# Altium schematic sheet 0082_USB3.SchDoc
size 848 x 558 mm
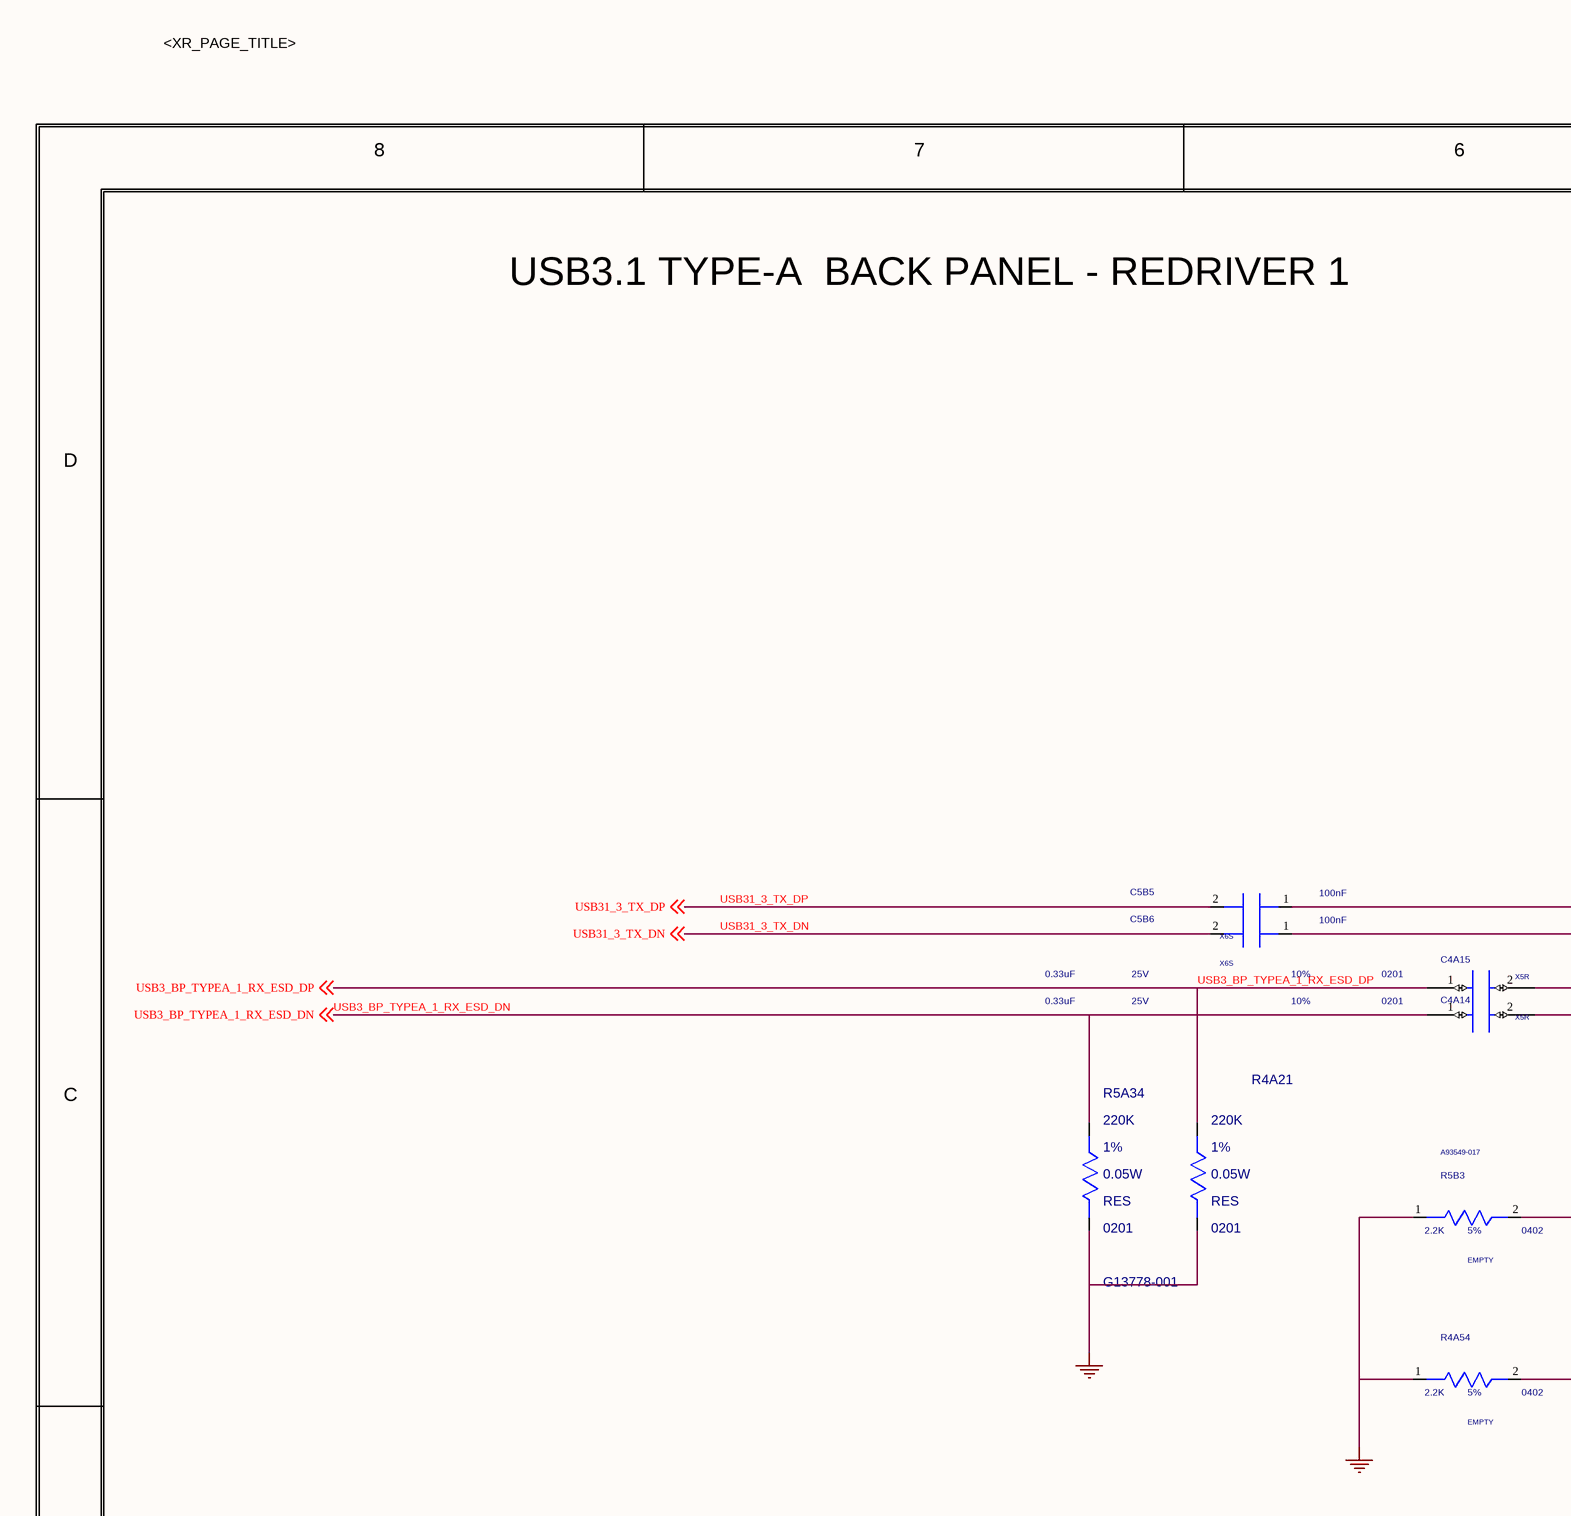
[diagram p0: 0082_USB3.SchDoc, top left]
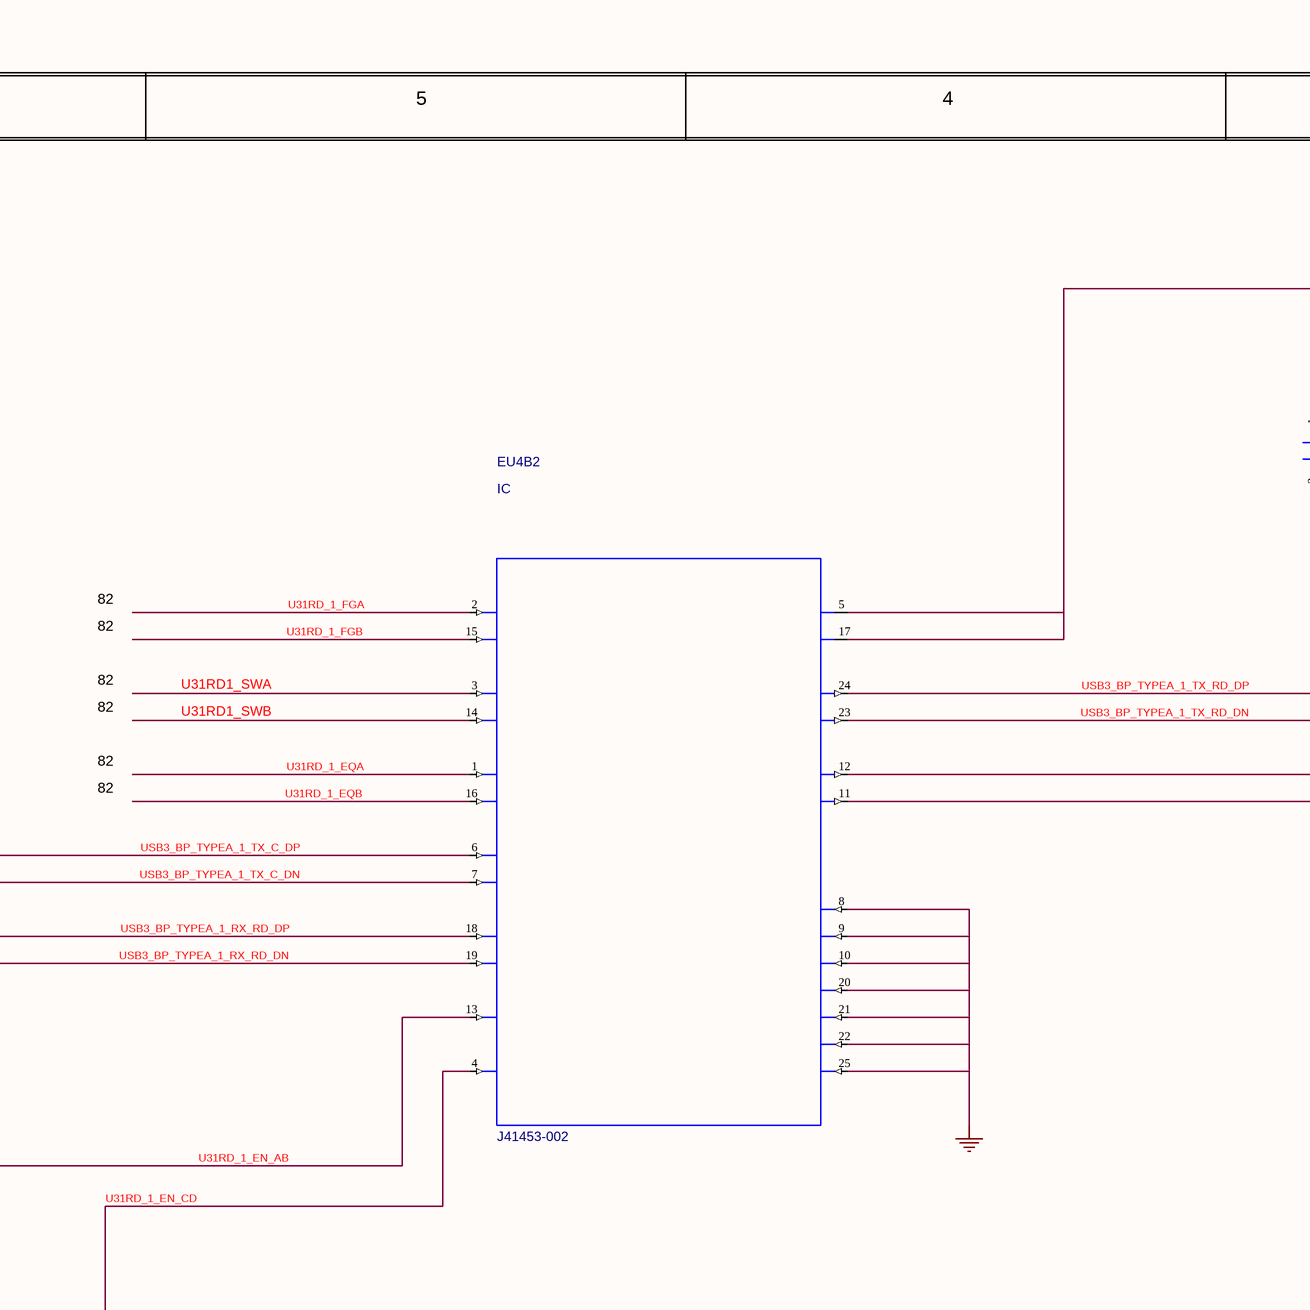
[diagram p1: 0082_USB3.SchDoc, top middle]
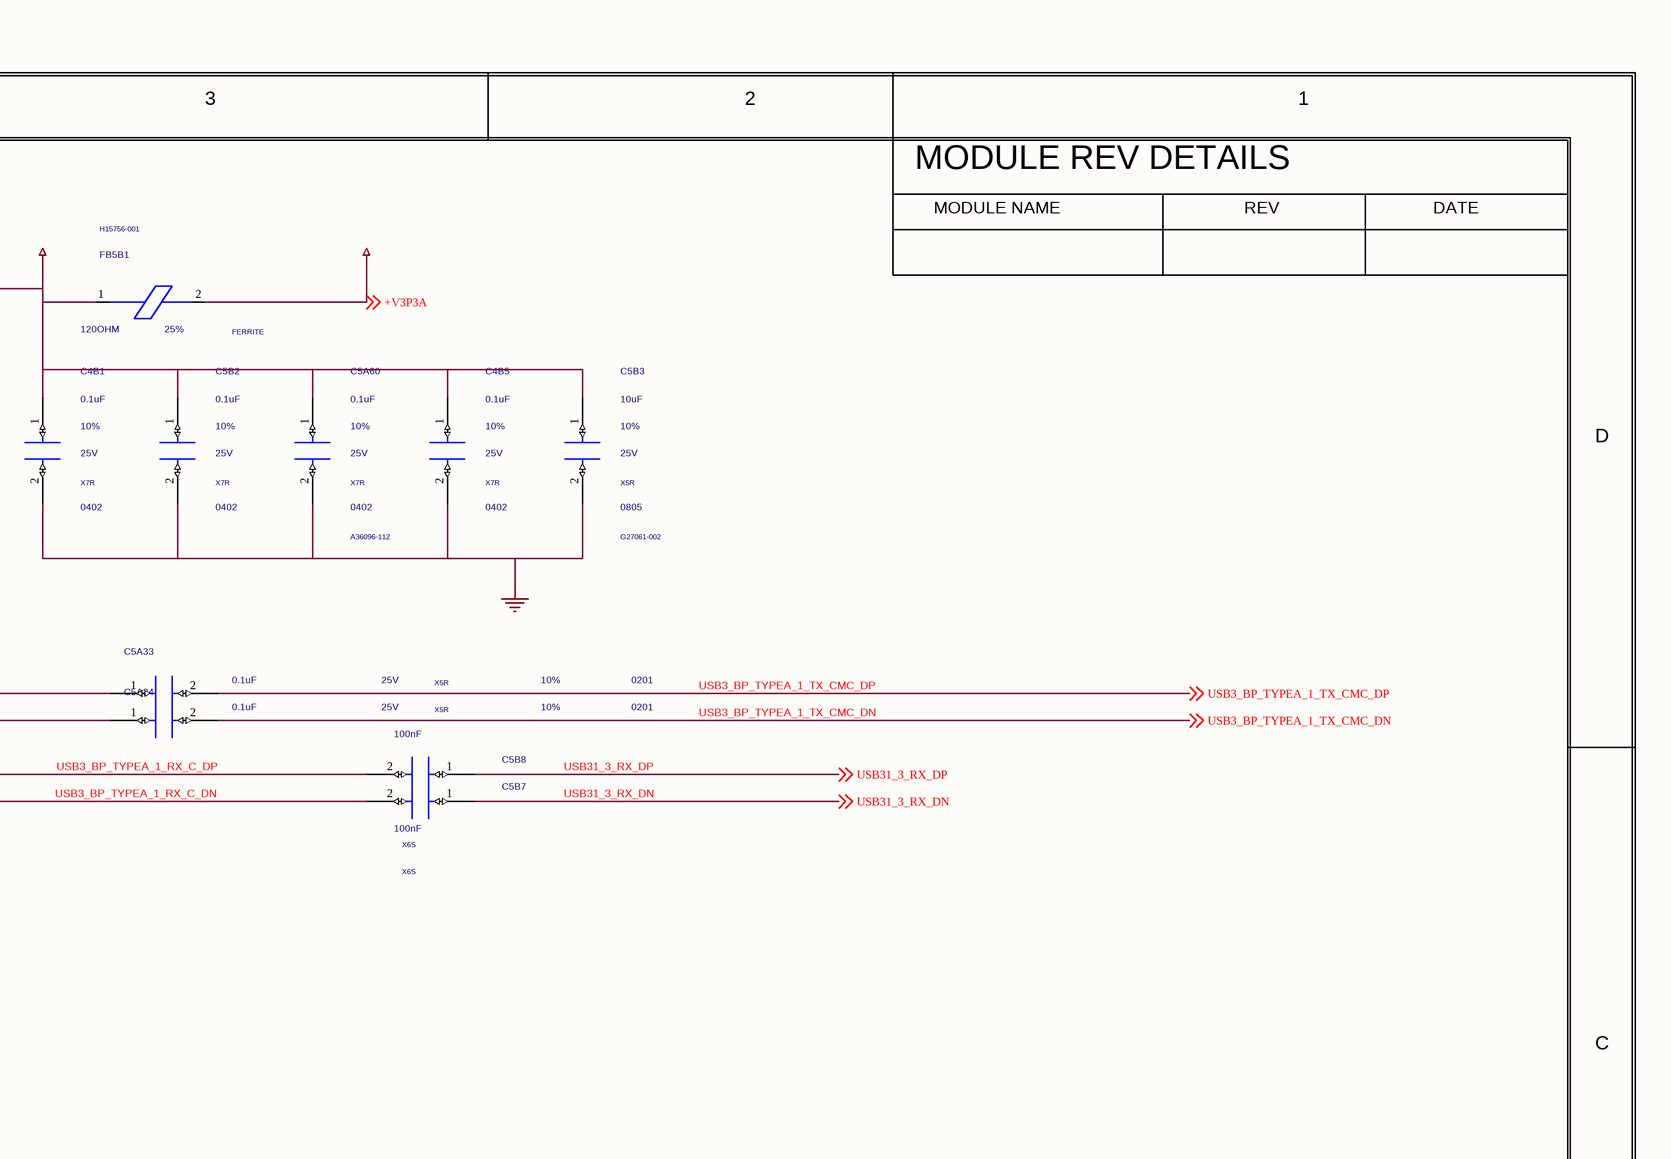
[diagram p2: 0082_USB3.SchDoc, top right]
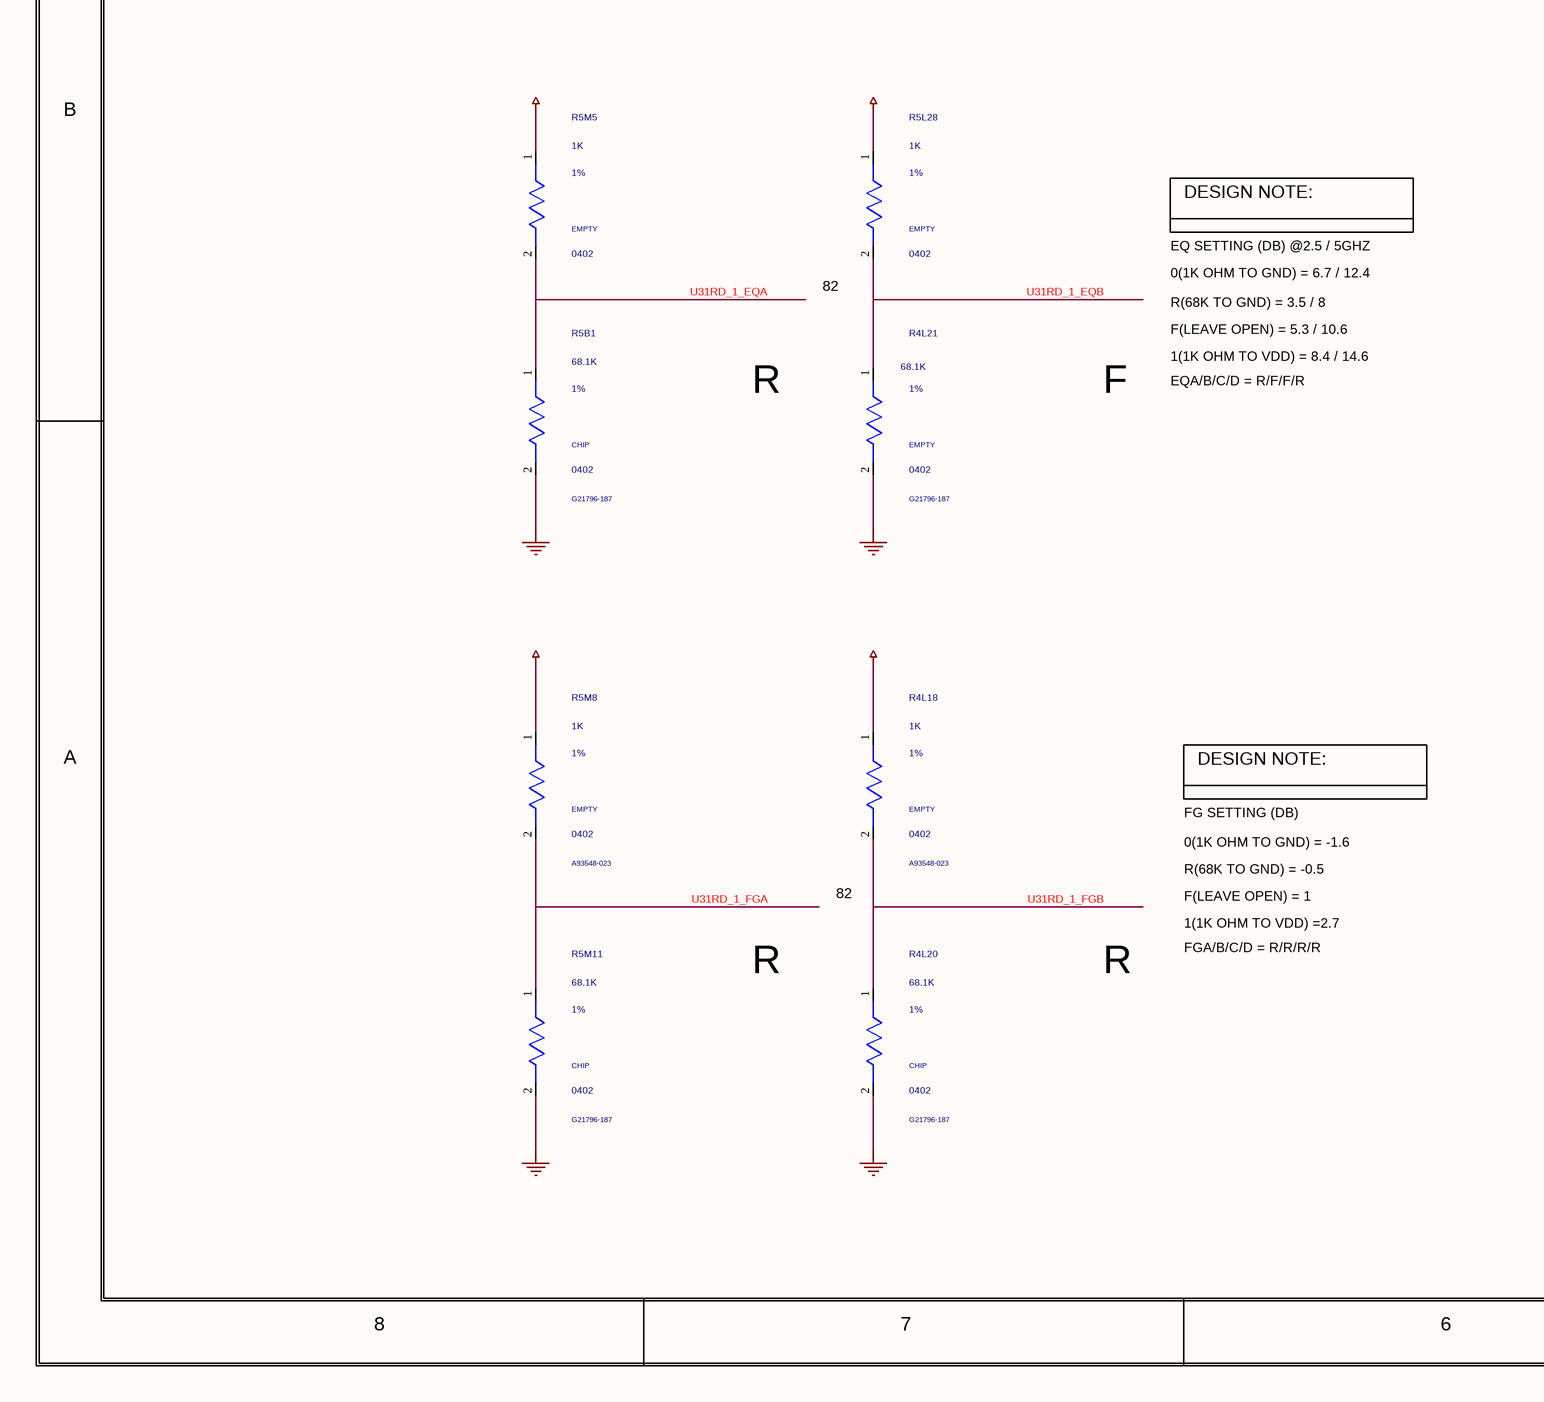
[diagram p3: 0082_USB3.SchDoc, bottom left]
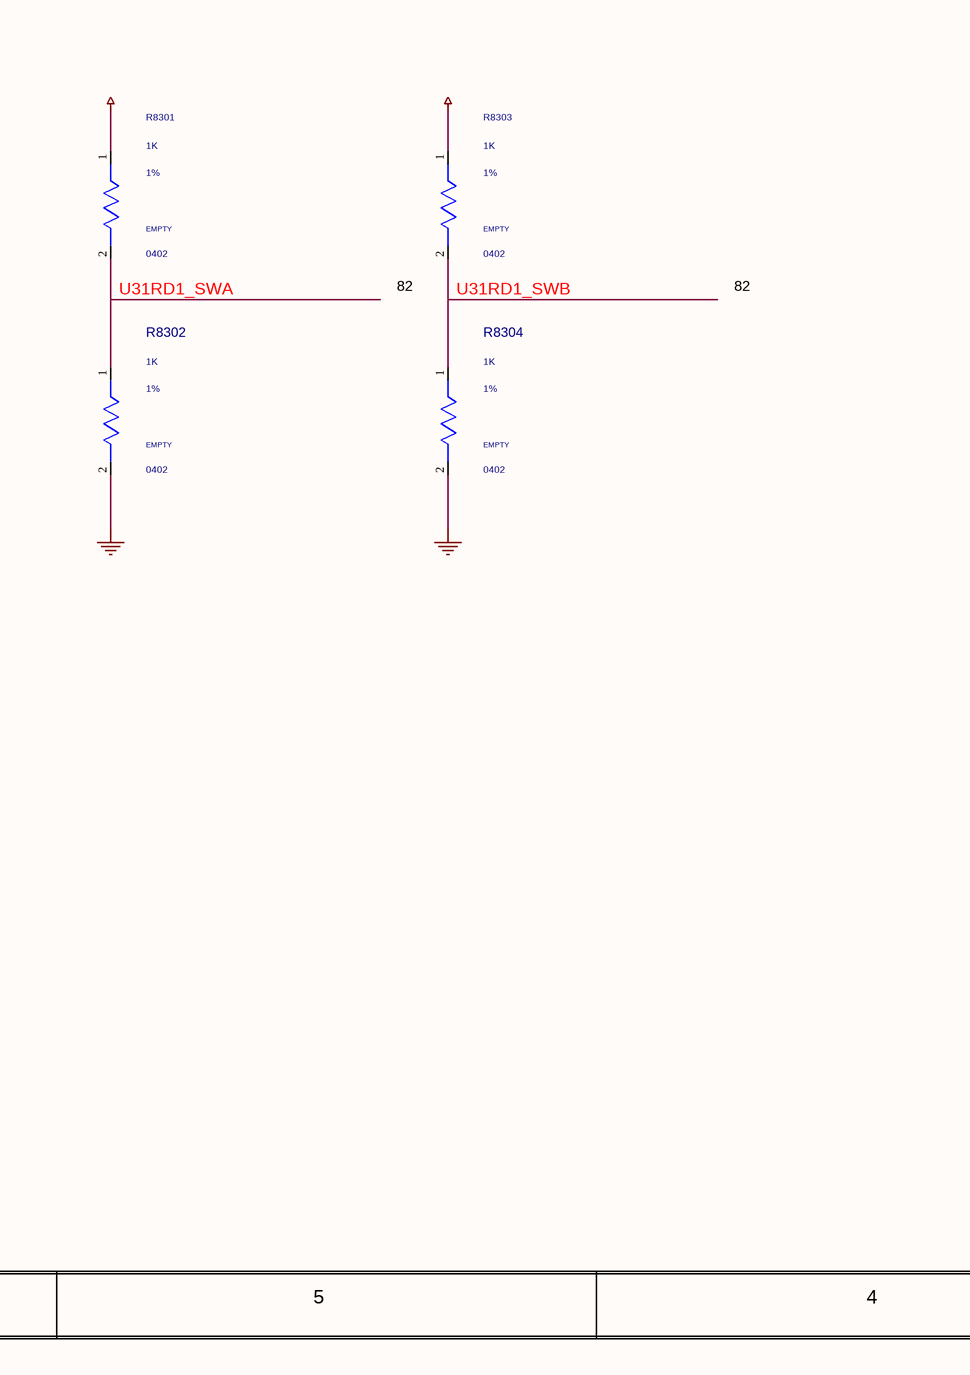
[diagram p4: 0082_USB3.SchDoc, bottom middle]
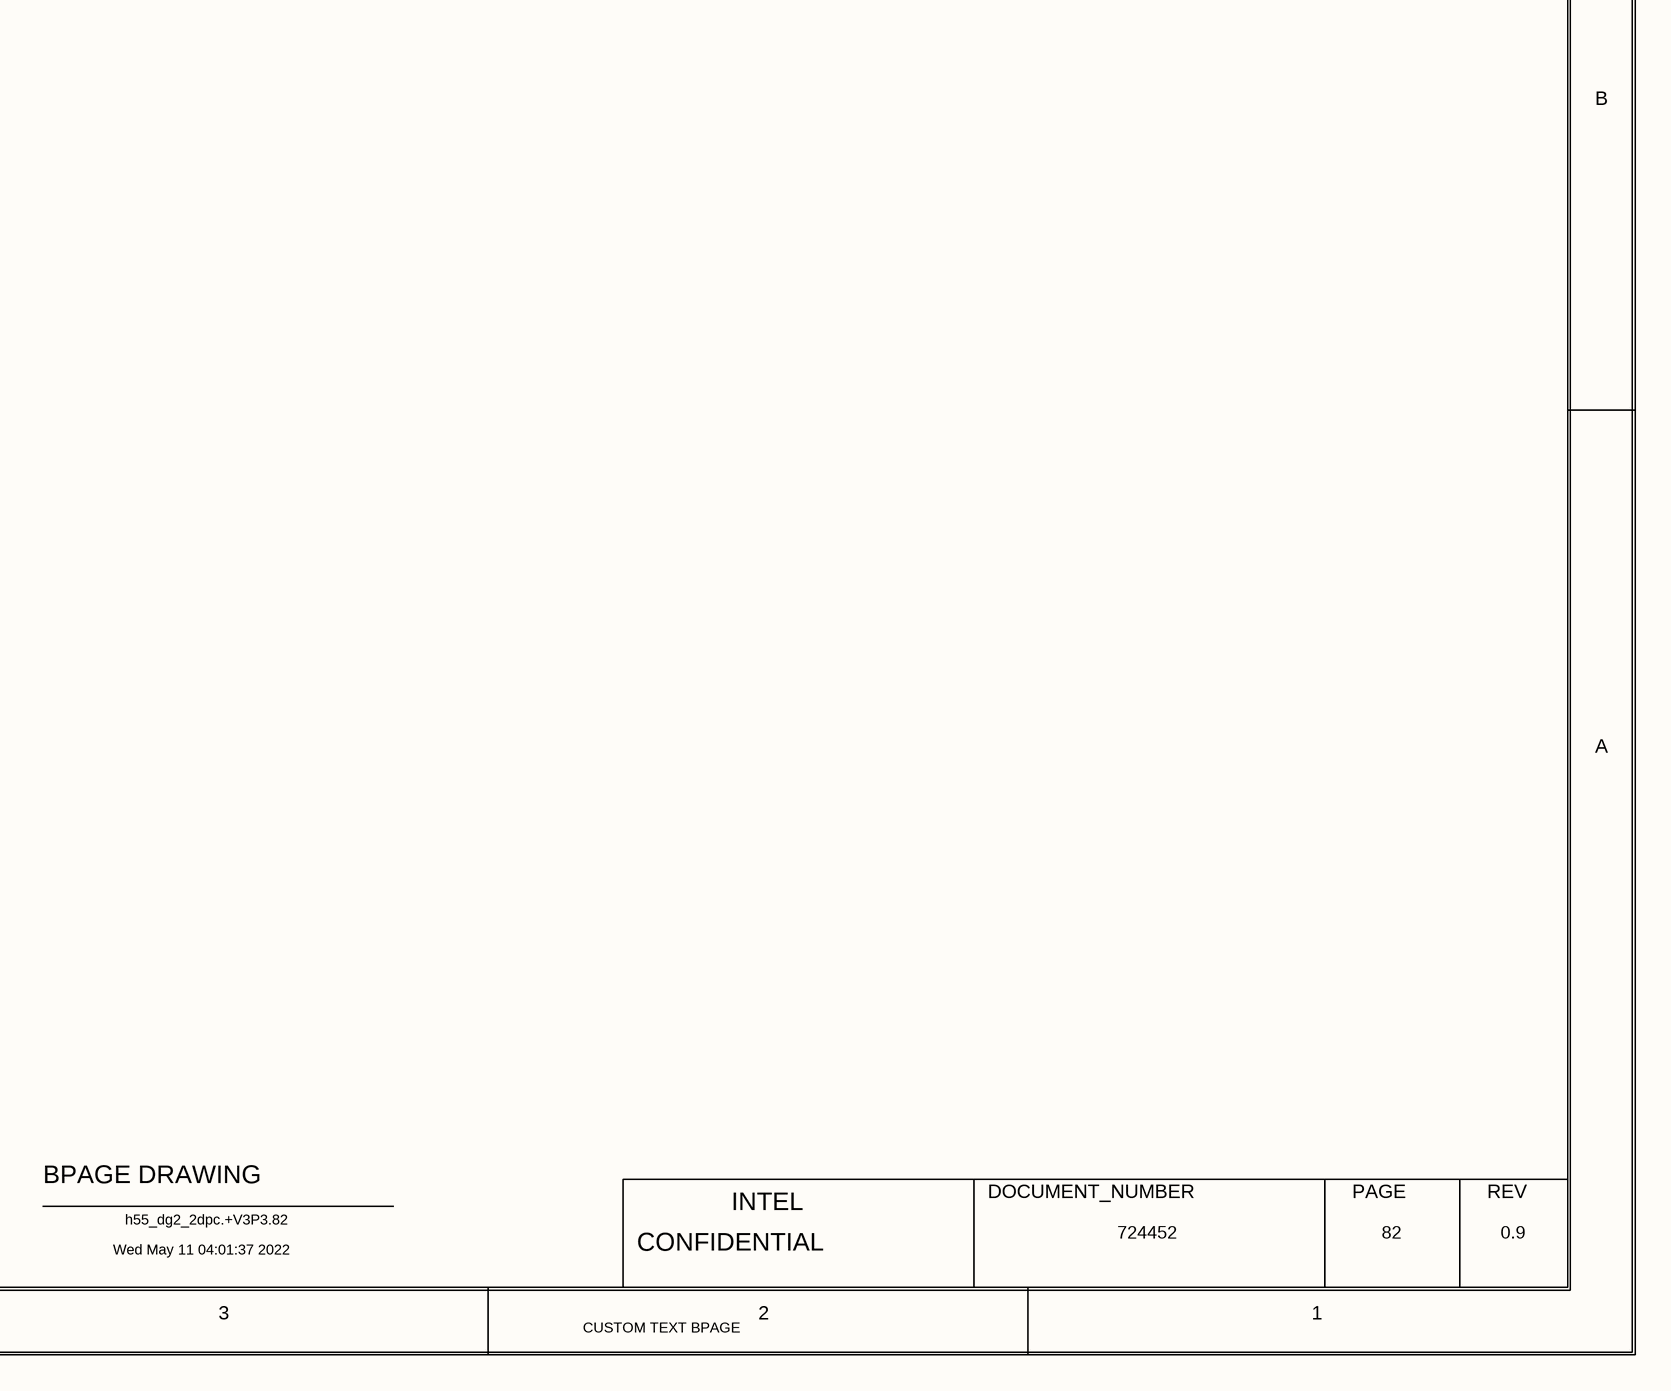
[diagram p5: 0082_USB3.SchDoc, bottom right]

## Parts
C4A14  0.33uF  MATERIAL: X5R  PACK_TYPE: 0201  TOLERANCE: 10%  VOLTAGE: 25V  [SMC0201IA]
C4A15  0.33uF  MATERIAL: X5R  PACK_TYPE: 0201  TOLERANCE: 10%  VOLTAGE: 25V  [SMC0201IA]
C4B1  0.1uF  MATERIAL: X7R  PACK_TYPE: 0402  TOLERANCE: 10%  VOLTAGE: 25V  [SMC0402IA]
C4B5  0.1uF  MATERIAL: X7R  PACK_TYPE: 0402  TOLERANCE: 10%  VOLTAGE: 25V  [SMC0402IA]
C5A33  0.1uF  MATERIAL: X5R  PACK_TYPE: 0201  TOLERANCE: 10%  VOLTAGE: 25V  [SMC0201IA]
C5A34  0.1uF  MATERIAL: X5R  PACK_TYPE: 0201  TOLERANCE: 10%  VOLTAGE: 25V  [SMC0201IA]
C5A60  0.1uF  MATERIAL: X7R  PACK_TYPE: 0402  PART_NUMBER: A36096-112  TOLERANCE: 10%  VOLTAGE: 25V  [SMC0402IA]
C5B2  0.1uF  MATERIAL: X7R  PACK_TYPE: 0402  TOLERANCE: 10%  VOLTAGE: 25V  [SMC0402IA]
C5B3  10uF  MATERIAL: X5R  PACK_TYPE: 0805  PART_NUMBER: G27061-002  TOLERANCE: 10%  VOLTAGE: 25V  [SMC0805MA]
C5B5  100nF  MATERIAL: X6S  [SMC0201IA]
C5B6  100nF  MATERIAL: X6S  [SMC0201IA]
C5B7  100nF  MATERIAL: X6S  [SMC0201IA]
C5B8  100nF  MATERIAL: X6S  [SMC0201IA]
EU4B2  MATERIAL: IC  PART_NUMBER: J41453-002  [CTK2_LCC24_S2550_350_DFS1400_MA]  (hidden comment: C_PI3EQX1002E)
FB5B1  120OHM  PART_NUMBER: H15756-001  TOLERANCE: 25%  [SFB0603IB]
R4A21  220K  MATERIAL: RES  PACK_TYPE: 0201  TOLERANCE: 1%  WATTAGE: 0.05W  [CTK2_SM0201_650X350_MA]
R4A54  2.2K  MATERIAL: EMPTY  PACK_TYPE: 0402  TOLERANCE: 5%  [SMR0402IA]
R4L18  1K  MATERIAL: EMPTY  PACK_TYPE: 0402  PART_NUMBER: A93548-023  TOLERANCE: 1%  [SMR0402IA]
R4L20  68.1K  MATERIAL: CHIP  PACK_TYPE: 0402  PART_NUMBER: G21796-187  TOLERANCE: 1%  [SMR0402IA]
R4L21  68.1K  MATERIAL: EMPTY  PACK_TYPE: 0402  PART_NUMBER: G21796-187  TOLERANCE: 1%  [SMR0402IA]
R5A34  220K  MATERIAL: RES  PACK_TYPE: 0201  PART_NUMBER: G13778-001  TOLERANCE: 1%  WATTAGE: 0.05W  [CTK2_SM0201_650X350_MA]
R5B1  68.1K  MATERIAL: CHIP  PACK_TYPE: 0402  PART_NUMBER: G21796-187  TOLERANCE: 1%  [SMR0402IA]
R5B3  2.2K  MATERIAL: EMPTY  PACK_TYPE: 0402  PART_NUMBER: A93549-017  TOLERANCE: 5%  [SMR0402IA]
R5L28  1K  MATERIAL: EMPTY  PACK_TYPE: 0402  TOLERANCE: 1%  [SMR0402IA]
R5M5  1K  MATERIAL: EMPTY  PACK_TYPE: 0402  TOLERANCE: 1%  [SMR0402IA]
R5M8  1K  MATERIAL: EMPTY  PACK_TYPE: 0402  PART_NUMBER: A93548-023  TOLERANCE: 1%  [SMR0402IA]
R5M11  68.1K  MATERIAL: CHIP  PACK_TYPE: 0402  PART_NUMBER: G21796-187  TOLERANCE: 1%  [SMR0402IA]
R8301  1K  MATERIAL: EMPTY  PACK_TYPE: 0402  TOLERANCE: 1%  [SMR0402IA]
R8302  1K  MATERIAL: EMPTY  PACK_TYPE: 0402  TOLERANCE: 1%  [SMR0402IA]
R8303  1K  MATERIAL: EMPTY  PACK_TYPE: 0402  TOLERANCE: 1%  [SMR0402IA]
R8304  1K  MATERIAL: EMPTY  PACK_TYPE: 0402  TOLERANCE: 1%  [SMR0402IA]

## Nets
+V3P3_DUAL_USBRD_1: C4B1.1(A) C4B5.1(A) C5A60.1(A) C5B2.1(A) C5B3.1(A) EU4B2.5(VDD_1) EU4B2.17(VDD_2) FB5B1.1(A) R4L18.1(A) R5L28.1(A) R5M5.1(A) R5M8.1(A) R8301.1(A) R8303.1(A)
+V3P3A: FB5B1.2(B) ; off-sheet +V3P3A
GND: C4B1.2(B) C4B5.2(B) C5A60.2(B) C5B2.2(B) C5B3.2(B) EU4B2.8(GND_1) EU4B2.9(GND_2) EU4B2.10(GND_3) EU4B2.20(GND_4) EU4B2.21(GND_5) EU4B2.22(GND_6) EU4B2.25(GND_TPD) R4A21.2(B) R4A54.1(A) R4L20.2(B) R4L21.2(B) R5A34.2(B) R5B1.2(B) R5B3.1(A) R5M11.2(B) R8302.2(B) R8304.2(B)
U31RD1_SWA: EU4B2.3(SWA) R8301.2(B) R8302.1(A)
U31RD1_SWB: EU4B2.14(SWB) R8303.2(B) R8304.1(A)
U31RD_1_EN_AB: EU4B2.13(RXDET_EN) R5B3.2(B)
U31RD_1_EN_CD: EU4B2.4(EN) R4A54.2(B)
U31RD_1_EQA: EU4B2.1(EQA) R5B1.1(A) R5M5.2(B)
U31RD_1_EQB: EU4B2.16(EQB) R4L21.1(A) R5L28.2(B)
U31RD_1_FGA: EU4B2.2(FGA) R5M8.2(B) R5M11.1(A)
U31RD_1_FGB: EU4B2.15(FGB) R4L18.2(B) R4L20.1(A)
USB3_BP_TYPEA_1_RX_C_DN: C5B7.2(B) EU4B2.11(BON)
USB3_BP_TYPEA_1_RX_C_DP: C5B8.2(B) EU4B2.12(BOP)
USB3_BP_TYPEA_1_RX_ESD_DN: C4A14.1(A) R5A34.1(A) ; off-sheet USB3_BP_TYPEA_1_RX_ESD_DN
USB3_BP_TYPEA_1_RX_ESD_DP: C4A15.1(A) R4A21.1(A) ; off-sheet USB3_BP_TYPEA_1_RX_ESD_DP
USB3_BP_TYPEA_1_RX_RD_DN: C4A14.2(B) EU4B2.19(BIN)
USB3_BP_TYPEA_1_RX_RD_DP: C4A15.2(B) EU4B2.18(BIP)
USB3_BP_TYPEA_1_TX_C_DN: C5B6.1(A) EU4B2.7(AIN)
USB3_BP_TYPEA_1_TX_C_DP: C5B5.1(A) EU4B2.6(AIP)
USB3_BP_TYPEA_1_TX_CMC_DN: C5A34.2(B) ; off-sheet USB3_BP_TYPEA_1_TX_CMC_DN
USB3_BP_TYPEA_1_TX_CMC_DP: C5A33.2(B) ; off-sheet USB3_BP_TYPEA_1_TX_CMC_DP
USB3_BP_TYPEA_1_TX_RD_DN: C5A34.1(A) EU4B2.23(AON)
USB3_BP_TYPEA_1_TX_RD_DP: C5A33.1(A) EU4B2.24(AOP)
USB31_3_RX_DN: C5B7.1(A) ; off-sheet USB31_3_RX_DN
USB31_3_RX_DP: C5B8.1(A) ; off-sheet USB31_3_RX_DP
USB31_3_TX_DN: C5B6.2(B) ; off-sheet USB31_3_TX_DN
USB31_3_TX_DP: C5B5.2(B) ; off-sheet USB31_3_TX_DP

## Notes on the sheet
- <XR_PAGE_TITLE>
- 8
- 7
- 6
- 5
- 4
- 3
- 2
- 1
- MODULE REV DETAILS
- USB3.1 TYPE-A  BACK PANEL - REDRIVER 1
- MODULE NAME
- REV
- DATE
- D
- 82
- C
- B
- DESIGN NOTE:
- EQ SETTING (DB) @2.5 / 5GHZ
- 0(1K OHM TO GND) = 6.7 / 12.4
- (near R5L28) 82
- R(68K TO GND) = 3.5 / 8
- F(LEAVE OPEN) = 5.3 / 10.6
- (near R8303) 82
- R
- F
- 1(1K OHM TO VDD) = 8.4 / 14.6
- EQA/B/C/D = R/F/F/R
- A
- FG SETTING (DB)
- R(68K TO GND) = -0.5
- 0(1K OHM TO GND) = -1.6
- F(LEAVE OPEN) = 1
- 1(1K OHM TO VDD) =2.7
- FGA/B/C/D = R/R/R/R
- BPAGE DRAWING
- INTEL
- DOCUMENT_NUMBER
- PAGE
- Wed May 11 04:01:37 2022
- h55_dg2_2dpc.+V3P3.82
- CONFIDENTIAL
- 724452
- 0.9
- CUSTOM TEXT BPAGE

## Library data of the parts
C4A14 = CAP#1: PART_NUMBER: J96611-001; CHIPS_PART_NAME: CAP; CDS_PHYS_PART_NAME: CAP_0201-J96611-001,X5R,0.33UF,25V,10%,LPDB,GENERIC; OriginalSymbolOrigin: (-25,50); XY: (-5450,3475); VER: 2; ROT: 0; PHYS_PAGE: 82; LOCATION: C4A14; IP: GENERIC; FP_TECH: LPDB; DRAWING: @RVP1_ADL_SB_ADP_S_DDR5_SODIMM_2DPC_LIB.H55_DG2_2DPC(SCH_1):PAGE454; CDS_LIB: discrete; PCB Footprint: SMC0201IA; SEC_TYPE: 0201; CDS_PART_NAME: CAP_0201-J96611-001,X5R,0.33UF,25V,10%,LPDB,GENERIC; CDS_LOCATION: C4A14; ASI_MODEL: J96611-001
C4A15 = CAP#1: PART_NUMBER: J96611-001; CHIPS_PART_NAME: CAP; CDS_PHYS_PART_NAME: CAP_0201-J96611-001,X5R,0.33UF,25V,10%,LPDB,GENERIC; OriginalSymbolOrigin: (-25,50); XY: (-5450,3525); VER: 2; ROT: 0; PHYS_PAGE: 82; LOCATION: C4A15; IP: GENERIC; FP_TECH: LPDB; DRAWING: @RVP1_ADL_SB_ADP_S_DDR5_SODIMM_2DPC_LIB.H55_DG2_2DPC(SCH_1):PAGE454; CDS_LIB: discrete; PCB Footprint: SMC0201IA; SEC_TYPE: 0201; CDS_PART_NAME: CAP_0201-J96611-001,X5R,0.33UF,25V,10%,LPDB,GENERIC; CDS_LOCATION: C4A15; ASI_MODEL: J96611-001
C4B1 = CAP: PART_NUMBER: A36096-112; CDS_PHYS_PART_NAME: CAP_0402-A36096-112,X7R,0.1UF,25V,10%,LPDB,GENERIC; OriginalSymbolOrigin: (-50,25); XY: (-2825,4425); VER: 1; ROT: 0; PHYS_PAGE: 82; LOCATION: C4B1; IP: GENERIC; FP_TECH: LPDB; DRAWING: @RVP1_ADL_SB_ADP_S_DDR5_SODIMM_2DPC_LIB.H55_DG2_2DPC(SCH_1):PAGE454; CDS_LIB: discrete; PCB Footprint: SMC0402IA; CHIPS_PART_NAME: CAP; CDS_PART_NAME: CAP_0402-A36096-112,X7R,0.1UF,25V,10%,LPDB,GENERIC; CDS_LOCATION: C4B1; ASI_MODEL: A36096-112
C4B5 = CAP: PART_NUMBER: A36096-112; CDS_PHYS_PART_NAME: CAP_0402-A36096-112,X7R,0.1UF,25V,10%,LPDB,GENERIC; OriginalSymbolOrigin: (-50,25); XY: (-2075,4425); VER: 1; ROT: 0; PHYS_PAGE: 82; LOCATION: C4B5; IP: GENERIC; FP_TECH: LPDB; DRAWING: @RVP1_ADL_SB_ADP_S_DDR5_SODIMM_2DPC_LIB.H55_DG2_2DPC(SCH_1):PAGE454; CDS_LIB: discrete; PCB Footprint: SMC0402IA; CHIPS_PART_NAME: CAP; CDS_PART_NAME: CAP_0402-A36096-112,X7R,0.1UF,25V,10%,LPDB,GENERIC; CDS_LOCATION: C4B5; ASI_MODEL: A36096-112
C5A33 = CAP#1: PART_NUMBER: C83410-027; CHIPS_PART_NAME: CAP; CDS_PHYS_PART_NAME: CAP_0201-C83410-027,X5R,0.1UF,25V,10%,LPDB,GENERIC; OriginalSymbolOrigin: (-25,50); XY: (-2600,3975); VER: 2; ROT: 0; PHYS_PAGE: 82; LOCATION: C5A33; IP: GENERIC; FP_TECH: LPDB; DRAWING: @RVP1_ADL_SB_ADP_S_DDR5_SODIMM_2DPC_LIB.H55_DG2_2DPC(SCH_1):PAGE454; CDS_LIB: discrete; PCB Footprint: SMC0201IA; SEC_TYPE: 0201; CDS_PART_NAME: CAP_0201-C83410-027,X5R,0.1UF,25V,10%,LPDB,GENERIC; CDS_LOCATION: C5A33; ASI_MODEL: C83410-027
C5A34 = CAP#1: PART_NUMBER: C83410-027; CHIPS_PART_NAME: CAP; CDS_PHYS_PART_NAME: CAP_0201-C83410-027,X5R,0.1UF,25V,10%,LPDB,GENERIC; OriginalSymbolOrigin: (-25,50); XY: (-2600,3925); VER: 2; ROT: 0; PHYS_PAGE: 82; LOCATION: C5A34; IP: GENERIC; FP_TECH: LPDB; DRAWING: @RVP1_ADL_SB_ADP_S_DDR5_SODIMM_2DPC_LIB.H55_DG2_2DPC(SCH_1):PAGE454; CDS_LIB: discrete; PCB Footprint: SMC0201IA; SEC_TYPE: 0201; CDS_PART_NAME: CAP_0201-C83410-027,X5R,0.1UF,25V,10%,LPDB,GENERIC; CDS_LOCATION: C5A34; ASI_MODEL: C83410-027
C5A60 = CAP: CDS_PHYS_PART_NAME: CAP_0402-A36096-112,X7R,0.1UF,25V,10%,LPDB,GENERIC; OriginalSymbolOrigin: (-50,25); XY: (-2325,4425); VER: 1; ROT: 0; PHYS_PAGE: 82; LOCATION: C5A60; IP: GENERIC; FP_TECH: LPDB; DRAWING: @RVP1_ADL_SB_ADP_S_DDR5_SODIMM_2DPC_LIB.H55_DG2_2DPC(SCH_1):PAGE454; CDS_LIB: discrete; PCB Footprint: SMC0402IA; CHIPS_PART_NAME: CAP; CDS_PART_NAME: CAP_0402-A36096-112,X7R,0.1UF,25V,10%,LPDB,GENERIC; CDS_LOCATION: C5A60; ASI_MODEL: A36096-112
C5B2 = CAP: PART_NUMBER: A36096-112; CDS_PHYS_PART_NAME: CAP_0402-A36096-112,X7R,0.1UF,25V,10%,LPDB,GENERIC; OriginalSymbolOrigin: (-50,25); XY: (-2575,4425); VER: 1; ROT: 0; PHYS_PAGE: 82; LOCATION: C5B2; IP: GENERIC; FP_TECH: LPDB; DRAWING: @RVP1_ADL_SB_ADP_S_DDR5_SODIMM_2DPC_LIB.H55_DG2_2DPC(SCH_1):PAGE454; CDS_LIB: discrete; PCB Footprint: SMC0402IA; CHIPS_PART_NAME: CAP; CDS_PART_NAME: CAP_0402-A36096-112,X7R,0.1UF,25V,10%,LPDB,GENERIC; CDS_LOCATION: C5B2; ASI_MODEL: A36096-112
C5B3 = CAP: CDS_PHYS_PART_NAME: CAP_0805-G27061-002,X5R,10UF,25V,10%,LPDB,GENERIC; OriginalSymbolOrigin: (-50,25); XY: (-1825,4425); VER: 1; ROT: 0; PHYS_PAGE: 82; LOCATION: C5B3; IP: GENERIC; FP_TECH: LPDB; DRAWING: @RVP1_ADL_SB_ADP_S_DDR5_SODIMM_2DPC_LIB.H55_DG2_2DPC(SCH_1):PAGE454; CDS_LIB: discrete; PCB Footprint: SMC0805MA; CHIPS_PART_NAME: CAP; CDS_PART_NAME: CAP_0805-G27061-002,X5R,10UF,25V,10%,LPDB,GENERIC; CDS_LOCATION: C5B3; ASI_MODEL: G27061-002
C5B5 = CAP#2: PART_NUMBER: H68299-001; CHIPS_PART_NAME: CAP; CDS_PHYS_PART_NAME: CAP_0201-H68299-001,X6S,100NF,25V,10%,LPDB,GENERIC; PACK_TYPE: 0201; TOLERANCE: 10%; VOLTAGE: 25V; OriginalSymbolOrigin: (-75,25); XY: (-5900,3675); VER: 4; ROT: 2; PHYS_PAGE: 82; LOCATION: C5B5; IP: GENERIC; FP_TECH: LPDB; DRAWING: @RVP1_ADL_SB_ADP_S_DDR5_SODIMM_2DPC_LIB.H55_DG2_2DPC(SCH_1):PAGE454; CDS_LIB: discrete; PCB Footprint: SMC0201IA; SEC_TYPE: 0201; CDS_PART_NAME: CAP_0201-H68299-001,X6S,100NF,25V,10%,LPDB,GENERIC; CDS_LOCATION: C5B5; ASI_MODEL: H68299-001
C5B6 = CAP#2: PART_NUMBER: H68299-001; CHIPS_PART_NAME: CAP; CDS_PHYS_PART_NAME: CAP_0201-H68299-001,X6S,100NF,25V,10%,LPDB,GENERIC; PACK_TYPE: 0201; TOLERANCE: 10%; VOLTAGE: 25V; OriginalSymbolOrigin: (-75,25); XY: (-5900,3625); VER: 4; ROT: 2; PHYS_PAGE: 82; LOCATION: C5B6; IP: GENERIC; FP_TECH: LPDB; DRAWING: @RVP1_ADL_SB_ADP_S_DDR5_SODIMM_2DPC_LIB.H55_DG2_2DPC(SCH_1):PAGE454; CDS_LIB: discrete; PCB Footprint: SMC0201IA; SEC_TYPE: 0201; CDS_PART_NAME: CAP_0201-H68299-001,X6S,100NF,25V,10%,LPDB,GENERIC; CDS_LOCATION: C5B6; ASI_MODEL: H68299-001
C5B7 = CAP#1: PART_NUMBER: H68299-001; CHIPS_PART_NAME: CAP; CDS_PHYS_PART_NAME: CAP_0201-H68299-001,X6S,100NF,25V,10%,LPDB,GENERIC; PACK_TYPE: 0201; TOLERANCE: 10%; VOLTAGE: 25V; OriginalSymbolOrigin: (-25,50); XY: (-2125,3775); VER: 2; PHYS_PAGE: 82; LOCATION: C5B7; IP: GENERIC; FP_TECH: LPDB; DRAWING: @RVP1_ADL_SB_ADP_S_DDR5_SODIMM_2DPC_LIB.H55_DG2_2DPC(SCH_1):PAGE454; CDS_LIB: discrete; PCB Footprint: SMC0201IA; SEC_TYPE: 0201; ROT: 2; CDS_PART_NAME: CAP_0201-H68299-001,X6S,100NF,25V,10%,LPDB,GENERIC; CDS_LOCATION: C5B7; ASI_MODEL: H68299-001
C5B8 = CAP#1: PART_NUMBER: H68299-001; CHIPS_PART_NAME: CAP; CDS_PHYS_PART_NAME: CAP_0201-H68299-001,X6S,100NF,25V,10%,LPDB,GENERIC; PACK_TYPE: 0201; TOLERANCE: 10%; VOLTAGE: 25V; OriginalSymbolOrigin: (-25,50); XY: (-2125,3825); VER: 2; PHYS_PAGE: 82; LOCATION: C5B8; IP: GENERIC; FP_TECH: LPDB; DRAWING: @RVP1_ADL_SB_ADP_S_DDR5_SODIMM_2DPC_LIB.H55_DG2_2DPC(SCH_1):PAGE454; CDS_LIB: discrete; PCB Footprint: SMC0201IA; SEC_TYPE: 0201; ROT: 2; CDS_PART_NAME: CAP_0201-H68299-001,X6S,100NF,25V,10%,LPDB,GENERIC; CDS_LOCATION: C5B8; ASI_MODEL: H68299-001
EU4B2 = C_PI3EQX1002E: CDS_PHYS_PART_NAME: C_PI3EQX1002E_LCC-J41453-002,IC,PI3EQX1002E2ZREX,TK2,GENERIC; CDS_LMAN_SYM_OUTLINE: -300,550,300,-500; FP_TECH: TK2; IP: GENERIC; PACK_TYPE: LCC; ROOM: NONE; OriginalSymbolOrigin: (-325,550); XY: (-4050,3675); VER: 1; ROT: 0; PHYS_PAGE: 82; LOCATION: EU4B2; DRAWING: @RVP1_ADL_SB_ADP_S_DDR5_SODIMM_2DPC_LIB.H55_DG2_2DPC(SCH_1):PAGE454; CDS_LIB: local; VARIANT: ?; PCB Footprint: CTK2_LCC24_S2550_350_DFS1400_MA; CHIPS_PART_NAME: C_PI3EQX1002E; CDS_PART_NAME: C_PI3EQX1002E_LCC-J41453-002,IC,PI3EQX1002E2ZREX,TK2,GENERIC; CDS_LOCATION: EU4B2
FB5B1 = FERRITE: CDS_PHYS_PART_NAME: FERRITE_0603-H15756-001,FERRITE,120OHM,25%,3A,LPDB,GENERIC; CURRENT: 3A; PACK_TYPE: 0603; OriginalSymbolOrigin: (-75,50); XY: (-2625,4700); VER: 1; ROT: 0; PHYS_PAGE: 82; LOCATION: FB5B1; IP: GENERIC; FP_TECH: LPDB; DRAWING: @RVP1_ADL_SB_ADP_S_DDR5_SODIMM_2DPC_LIB.H55_DG2_2DPC(SCH_1):PAGE454; CDS_LIB: discrete; MATERIAL: FERRITE; PCB Footprint: SFB0603IB; SEC_TYPE: 0603; CHIPS_PART_NAME: FERRITE; CDS_PART_NAME: FERRITE_0603-H15756-001,FERRITE,120OHM,25%,3A,LPDB,GENERIC; CDS_LOCATION: FB5B1
R4A21 = C_RES: PART_NUMBER: G13778-001; CDS_PHYS_PART_NAME: C_RES_0201-G13778-001,RES,220K,1%,0.05W,TK2,GENERIC; CDS_LMAN_SYM_OUTLINE: -50,50,50,-50; FP_TECH: TK2; IP: GENERIC; ROOM: NONE; OriginalSymbolOrigin: (-25,75); XY: (-5975,3175); VER: 2; ROT: 0; PHYS_PAGE: 82; LOCATION: R4A21; DRAWING: @RVP1_ADL_SB_ADP_S_DDR5_SODIMM_2DPC_LIB.H55_DG2_2DPC(SCH_1):PAGE454; CDS_LIB: c_discrete; VARIANT: ?; PCB Footprint: CTK2_SM0201_650X350_MA; CHIPS_PART_NAME: C_RES; CDS_PART_NAME: C_RES_0201-G13778-001,RES,220K,1%,0.05W,TK2,GENERIC; CDS_LOCATION: R4A21
R4A54 = RES#1: PART_NUMBER: A93549-017; CHIPS_PART_NAME: RES; CDS_PHYS_PART_NAME: RES_0402-A93549-017,EMPTY,2.2K,5%,1/16W,LPDB,GENERIC; WATTAGE: 1/16W; OriginalSymbolOrigin: (-75,25); XY: (-5475,2800); VER: 1; ROT: 0; PHYS_PAGE: 82; LOCATION: R4A54; IP: GENERIC; FP_TECH: LPDB; DRAWING: @RVP1_ADL_SB_ADP_S_DDR5_SODIMM_2DPC_LIB.H55_DG2_2DPC(SCH_1):PAGE454; CDS_LIB: discrete; PCB Footprint: SMR0402IA; SEC_TYPE: 0402; CDS_PART_NAME: RES_0402-A93549-017,EMPTY,2.2K,5%,1/16W,LPDB,GENERIC; CDS_LOCATION: R4A54; ASI_MODEL: A93549-017
R4L18 = RES: CDS_PHYS_PART_NAME: RES_0402-A93548-023,EMPTY,1K,1%,1/16W,LPDB,GENERIC; WATTAGE: 1/16W; OriginalSymbolOrigin: (-25,75); XY: (-6575,950); VER: 2; ROT: 0; PHYS_PAGE: 82; LOCATION: R4L18; IP: GENERIC; FP_TECH: LPDB; DRAWING: @RVP1_ADL_SB_ADP_S_DDR5_SODIMM_2DPC_LIB.H55_DG2_2DPC(SCH_1):PAGE454; CDS_LIB: discrete; PCB Footprint: SMR0402IA; CHIPS_PART_NAME: RES; CDS_PART_NAME: RES_0402-A93548-023,EMPTY,1K,1%,1/16W,LPDB,GENERIC; CDS_LOCATION: R4L18; ASI_MODEL: A93548-023
R4L20 = RES: CDS_PHYS_PART_NAME: RES_0402-G21796-187,CHIP,68.1K,1%,1/16W,LPDB,GENERIC; WATTAGE: 1/16W; OriginalSymbolOrigin: (-25,75); XY: (-6575,475); VER: 2; ROT: 0; PHYS_PAGE: 82; LOCATION: R4L20; IP: GENERIC; FP_TECH: LPDB; DRAWING: @RVP1_ADL_SB_ADP_S_DDR5_SODIMM_2DPC_LIB.H55_DG2_2DPC(SCH_1):PAGE454; CDS_LIB: discrete; PCB Footprint: SMR0402IA; SEC_TYPE: 0402; CHIPS_PART_NAME: RES; CDS_PART_NAME: RES_0402-G21796-187,CHIP,68.1K,1%,1/16W,LPDB,GENERIC; CDS_LOCATION: R4L20; ASI_MODEL: G21796-187
R4L21 = RES: CDS_PHYS_PART_NAME: RES_0402-G21796-187,EMPTY,68.1K,1%,1/16W,LPDB,GENERIC; WATTAGE: 1/16W; OriginalSymbolOrigin: (-25,75); XY: (-6575,1625); VER: 2; ROT: 0; PHYS_PAGE: 82; LOCATION: R4L21; IP: GENERIC; FP_TECH: LPDB; DRAWING: @RVP1_ADL_SB_ADP_S_DDR5_SODIMM_2DPC_LIB.H55_DG2_2DPC(SCH_1):PAGE454; CDS_LIB: discrete; PCB Footprint: SMR0402IA; CHIPS_PART_NAME: RES; CDS_PART_NAME: RES_0402-G21796-187,EMPTY,68.1K,1%,1/16W,LPDB,GENERIC; CDS_LOCATION: R4L21; ASI_MODEL: G21796-187
R5A34 = C_RES: CDS_PHYS_PART_NAME: C_RES_0201-G13778-001,RES,220K,1%,0.05W,TK2,GENERIC; CDS_LMAN_SYM_OUTLINE: -50,50,50,-50; FP_TECH: TK2; IP: GENERIC; ROOM: NONE; OriginalSymbolOrigin: (-25,75); XY: (-6175,3175); VER: 2; ROT: 0; PHYS_PAGE: 82; LOCATION: R5A34; DRAWING: @RVP1_ADL_SB_ADP_S_DDR5_SODIMM_2DPC_LIB.H55_DG2_2DPC(SCH_1):PAGE454; CDS_LIB: c_discrete; VARIANT: ?; PCB Footprint: CTK2_SM0201_650X350_MA; CHIPS_PART_NAME: C_RES; CDS_PART_NAME: C_RES_0201-G13778-001,RES,220K,1%,0.05W,TK2,GENERIC; CDS_LOCATION: R5A34
R5B1 = RES: CDS_PHYS_PART_NAME: RES_0402-G21796-187,CHIP,68.1K,1%,1/16W,LPDB,GENERIC; WATTAGE: 1/16W; OriginalSymbolOrigin: (-25,75); XY: (-7200,1625); VER: 2; ROT: 0; PHYS_PAGE: 82; LOCATION: R5B1; IP: GENERIC; FP_TECH: LPDB; DRAWING: @RVP1_ADL_SB_ADP_S_DDR5_SODIMM_2DPC_LIB.H55_DG2_2DPC(SCH_1):PAGE454; CDS_LIB: discrete; PCB Footprint: SMR0402IA; CHIPS_PART_NAME: RES; CDS_PART_NAME: RES_0402-G21796-187,CHIP,68.1K,1%,1/16W,LPDB,GENERIC; CDS_LOCATION: R5B1; ASI_MODEL: G21796-187
R5B3 = RES#1: CHIPS_PART_NAME: RES; CDS_PHYS_PART_NAME: RES_0402-A93549-017,EMPTY,2.2K,5%,1/16W,LPDB,GENERIC; WATTAGE: 1/16W; OriginalSymbolOrigin: (-75,25); XY: (-5475,3100); VER: 1; ROT: 0; PHYS_PAGE: 82; LOCATION: R5B3; IP: GENERIC; FP_TECH: LPDB; DRAWING: @RVP1_ADL_SB_ADP_S_DDR5_SODIMM_2DPC_LIB.H55_DG2_2DPC(SCH_1):PAGE454; CDS_LIB: discrete; PCB Footprint: SMR0402IA; SEC_TYPE: 0402; CDS_PART_NAME: RES_0402-A93549-017,EMPTY,2.2K,5%,1/16W,LPDB,GENERIC; CDS_LOCATION: R5B3; ASI_MODEL: A93549-017
R5L28 = RES: PART_NUMBER: A93548-023; CDS_PHYS_PART_NAME: RES_0402-A93548-023,EMPTY,1K,1%,1/16W,LPDB,GENERIC; WATTAGE: 1/16W; OriginalSymbolOrigin: (-25,75); XY: (-6575,2025); VER: 2; ROT: 0; PHYS_PAGE: 82; LOCATION: R5L28; IP: GENERIC; FP_TECH: LPDB; DRAWING: @RVP1_ADL_SB_ADP_S_DDR5_SODIMM_2DPC_LIB.H55_DG2_2DPC(SCH_1):PAGE454; CDS_LIB: discrete; PCB Footprint: SMR0402IA; CHIPS_PART_NAME: RES; CDS_PART_NAME: RES_0402-A93548-023,EMPTY,1K,1%,1/16W,LPDB,GENERIC; CDS_LOCATION: R5L28; ASI_MODEL: A93548-023
R5M5 = RES: PART_NUMBER: A93548-023; CDS_PHYS_PART_NAME: RES_0402-A93548-023,EMPTY,1K,1%,1/16W,LPDB,GENERIC; WATTAGE: 1/16W; OriginalSymbolOrigin: (-25,75); XY: (-7200,2025); VER: 2; ROT: 0; PHYS_PAGE: 82; LOCATION: R5M5; IP: GENERIC; FP_TECH: LPDB; DRAWING: @RVP1_ADL_SB_ADP_S_DDR5_SODIMM_2DPC_LIB.H55_DG2_2DPC(SCH_1):PAGE454; CDS_LIB: discrete; PCB Footprint: SMR0402IA; CHIPS_PART_NAME: RES; CDS_PART_NAME: RES_0402-A93548-023,EMPTY,1K,1%,1/16W,LPDB,GENERIC; CDS_LOCATION: R5M5; ASI_MODEL: A93548-023
R5M8 = RES: CDS_PHYS_PART_NAME: RES_0402-A93548-023,EMPTY,1K,1%,1/16W,LPDB,GENERIC; WATTAGE: 1/16W; OriginalSymbolOrigin: (-25,75); XY: (-7200,950); VER: 2; ROT: 0; PHYS_PAGE: 82; LOCATION: R5M8; IP: GENERIC; FP_TECH: LPDB; DRAWING: @RVP1_ADL_SB_ADP_S_DDR5_SODIMM_2DPC_LIB.H55_DG2_2DPC(SCH_1):PAGE454; CDS_LIB: discrete; PCB Footprint: SMR0402IA; CHIPS_PART_NAME: RES; CDS_PART_NAME: RES_0402-A93548-023,EMPTY,1K,1%,1/16W,LPDB,GENERIC; CDS_LOCATION: R5M8; ASI_MODEL: A93548-023
R5M11 = RES: CDS_PHYS_PART_NAME: RES_0402-G21796-187,CHIP,68.1K,1%,1/16W,LPDB,GENERIC; WATTAGE: 1/16W; OriginalSymbolOrigin: (-25,75); XY: (-7200,475); VER: 2; ROT: 0; PHYS_PAGE: 82; LOCATION: R5M11; IP: GENERIC; FP_TECH: LPDB; DRAWING: @RVP1_ADL_SB_ADP_S_DDR5_SODIMM_2DPC_LIB.H55_DG2_2DPC(SCH_1):PAGE454; CDS_LIB: discrete; PCB Footprint: SMR0402IA; SEC_TYPE: 0402; CHIPS_PART_NAME: RES; CDS_PART_NAME: RES_0402-G21796-187,CHIP,68.1K,1%,1/16W,LPDB,GENERIC; CDS_LOCATION: R5M11; ASI_MODEL: G21796-187
R8301 = RES: PART_NUMBER: A93548-023; CDS_PHYS_PART_NAME: RES_0402-A93548-023,EMPTY,1K,1%,1/16W,LPDB,GENERIC; WATTAGE: 1/16W; OriginalSymbolOrigin: (-25,75); XY: (-4900,1975); VER: 2; ROT: 0; PHYS_PAGE: 82; LOCATION: R8301; IP: GENERIC; FP_TECH: LPDB; DRAWING: @RVP1_ADL_SB_ADP_S_DDR5_SODIMM_2DPC_LIB.H55_DG2_2DPC(SCH_1):PAGE454; CDS_LIB: discrete; PCB Footprint: SMR0402IA; CHIPS_PART_NAME: RES; CDS_PART_NAME: RES_0402-A93548-023,EMPTY,1K,1%,1/16W,LPDB,GENERIC; CDS_LOCATION: R8301; ASI_MODEL: A93548-023
R8302 = RES: PART_NUMBER: A93548-023; CDS_PHYS_PART_NAME: RES_0402-A93548-023,EMPTY,1K,1%,1/16W,LPDB,GENERIC; WATTAGE: 1/16W; OriginalSymbolOrigin: (-25,75); XY: (-4900,1575); VER: 2; ROT: 0; PHYS_PAGE: 82; LOCATION: R8302; IP: GENERIC; FP_TECH: LPDB; DRAWING: @RVP1_ADL_SB_ADP_S_DDR5_SODIMM_2DPC_LIB.H55_DG2_2DPC(SCH_1):PAGE454; CDS_LIB: discrete; PCB Footprint: SMR0402IA; CHIPS_PART_NAME: RES; CDS_PART_NAME: RES_0402-A93548-023,EMPTY,1K,1%,1/16W,LPDB,GENERIC; CDS_LOCATION: R8302; ASI_MODEL: A93548-023
R8303 = RES: PART_NUMBER: A93548-023; CDS_PHYS_PART_NAME: RES_0402-A93548-023,EMPTY,1K,1%,1/16W,LPDB,GENERIC; WATTAGE: 1/16W; OriginalSymbolOrigin: (-25,75); XY: (-4275,1975); VER: 2; ROT: 0; PHYS_PAGE: 82; LOCATION: R8303; IP: GENERIC; FP_TECH: LPDB; DRAWING: @RVP1_ADL_SB_ADP_S_DDR5_SODIMM_2DPC_LIB.H55_DG2_2DPC(SCH_1):PAGE454; CDS_LIB: discrete; PCB Footprint: SMR0402IA; CHIPS_PART_NAME: RES; CDS_PART_NAME: RES_0402-A93548-023,EMPTY,1K,1%,1/16W,LPDB,GENERIC; CDS_LOCATION: R8303; ASI_MODEL: A93548-023
R8304 = RES: PART_NUMBER: A93548-023; CDS_PHYS_PART_NAME: RES_0402-A93548-023,EMPTY,1K,1%,1/16W,LPDB,GENERIC; WATTAGE: 1/16W; OriginalSymbolOrigin: (-25,75); XY: (-4275,1575); VER: 2; ROT: 0; PHYS_PAGE: 82; LOCATION: R8304; IP: GENERIC; FP_TECH: LPDB; DRAWING: @RVP1_ADL_SB_ADP_S_DDR5_SODIMM_2DPC_LIB.H55_DG2_2DPC(SCH_1):PAGE454; CDS_LIB: discrete; PCB Footprint: SMR0402IA; CHIPS_PART_NAME: RES; CDS_PART_NAME: RES_0402-A93548-023,EMPTY,1K,1%,1/16W,LPDB,GENERIC; CDS_LOCATION: R8304; ASI_MODEL: A93548-023